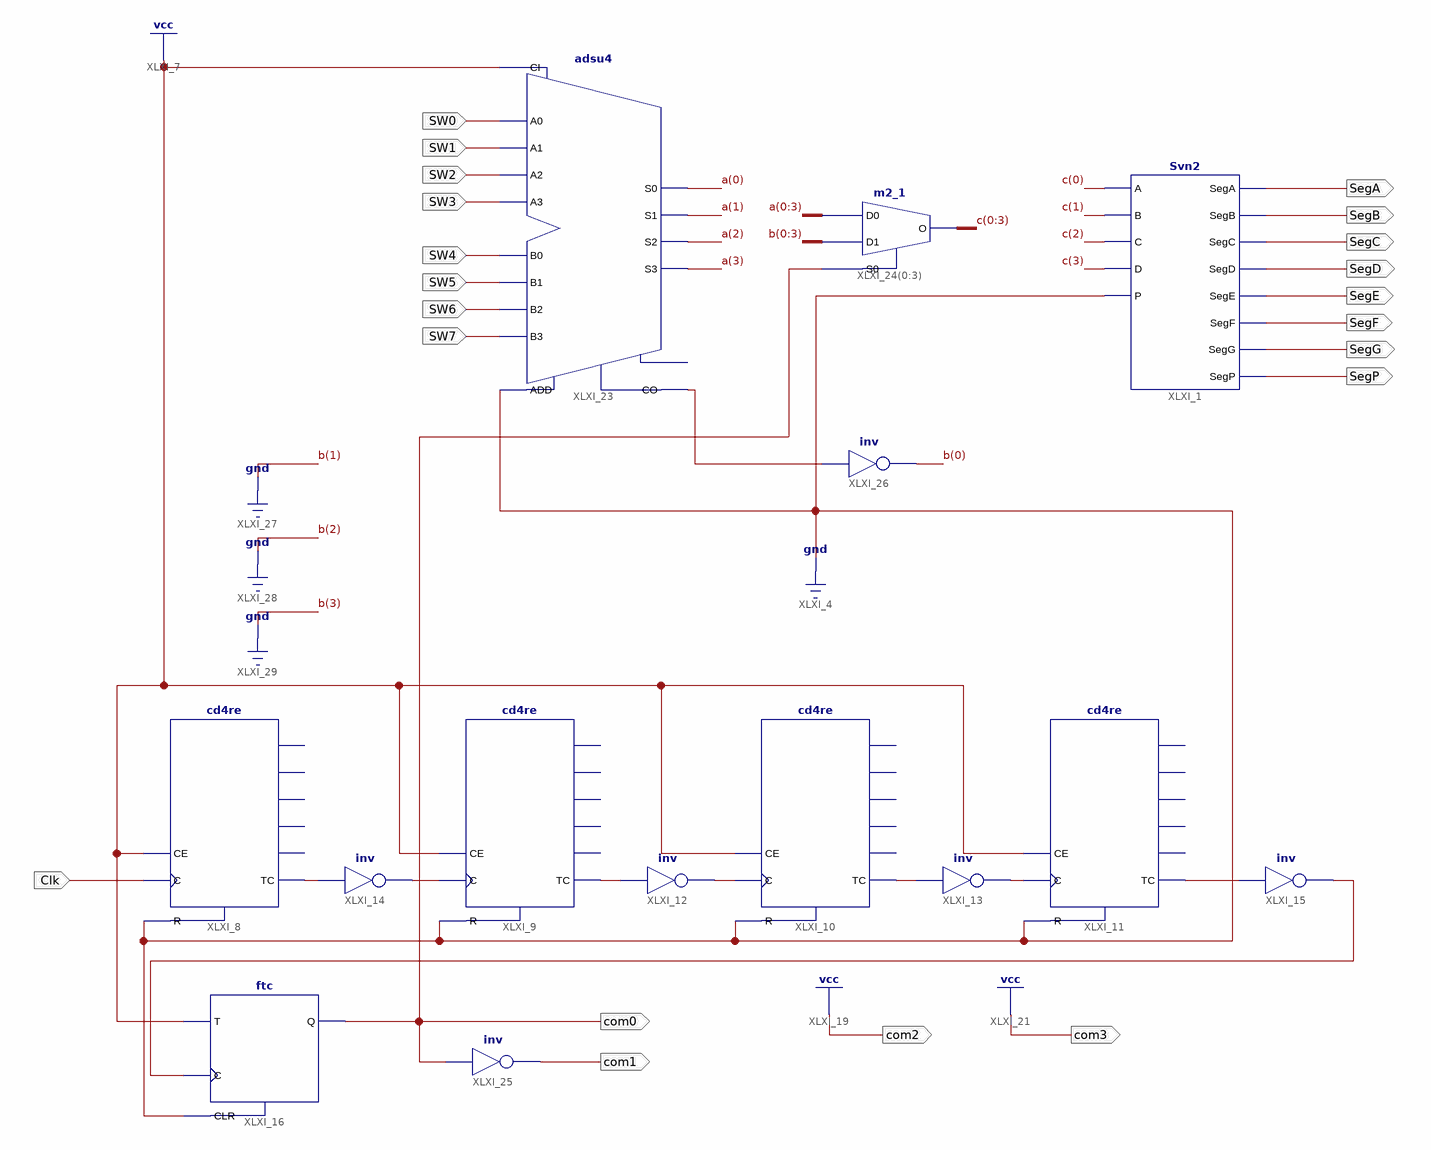
[diagram p0: schematic sheet 1]
// Xilinx ISE schematic Test.sch (spartan6) as structural Verilog: 14 symbols, 21 ports
module Test (
  input  SW0,
  input  SW1,
  input  SW2,
  input  SW3,
  input  SW4,
  input  SW5,
  input  SW6,
  input  SW7,
  input  Clk,
  output SegA,
  output SegB,
  output SegC,
  output SegD,
  output SegE,
  output SegF,
  output SegG,
  output SegP,
  output com2,
  output com3,
  output com0,
  output com1
);

  wire XLXN_45, XLXN_46, XLXN_47, XLXN_48, XLXN_49, XLXN_50, XLXN_51, XLXN_64, XLXN_108;
  wire [0:0] b;
  wire [3:0] a, c;

  Svn2 XLXI_1 (
    .A(c[0]), .B(c[1]), .C(c[2]), .D(c[3]), .P(1'b0), .SegA(SegA), .SegB(SegB), .SegC(SegC), .SegD(SegD),
    .SegE(SegE), .SegF(SegF), .SegG(SegG), .SegP(SegP));
  cd4re XLXI_8 (.C(Clk), .CE(1'b1), .R(1'b0), .TC(XLXN_45));  // open: CEO, Q0, Q1, Q2, Q3
  cd4re XLXI_9 (.C(XLXN_46), .CE(1'b1), .R(1'b0), .TC(XLXN_47));  // open: CEO, Q0, Q1, Q2, Q3
  cd4re XLXI_10 (.C(XLXN_48), .CE(1'b1), .R(1'b0), .TC(XLXN_49));  // open: CEO, Q0, Q1, Q2, Q3
  cd4re XLXI_11 (.C(XLXN_50), .CE(1'b1), .R(1'b0), .TC(XLXN_51));  // open: CEO, Q0, Q1, Q2, Q3
  not XLXI_12 (XLXN_48, XLXN_47);
  not XLXI_13 (XLXN_50, XLXN_49);
  not XLXI_14 (XLXN_46, XLXN_45);
  not XLXI_15 (XLXN_64, XLXN_51);
  adsu4 XLXI_23 (
    .A0(SW0), .A1(SW1), .A2(SW2), .A3(SW3), .ADD(1'b0), .B0(SW4), .B1(SW5), .B2(SW6), .B3(SW7), .CI(1'b1),
    .CO(XLXN_108), .S0(a[0]), .S1(a[1]), .S2(a[2]), .S3(a[3]));  // open: OFL
  m2_1 XLXI_24[0:3] (.D0({a[0], a[1], a[2], a[3]}), .D1({b[0], 3'b000}), .S0(com0), .O({c[0], c[1], c[2], c[3]}));
  ftc XLXI_16 (.C(XLXN_64), .CLR(1'b0), .T(1'b1), .Q(com0));
  not XLXI_25 (com1, com0);
  not XLXI_26 (b[0], XLXN_108);

  assign com2 = 1'b1;
  assign com3 = 1'b1;
endmodule
